# Altium schematic sheet FLASH.SchDoc
size A4
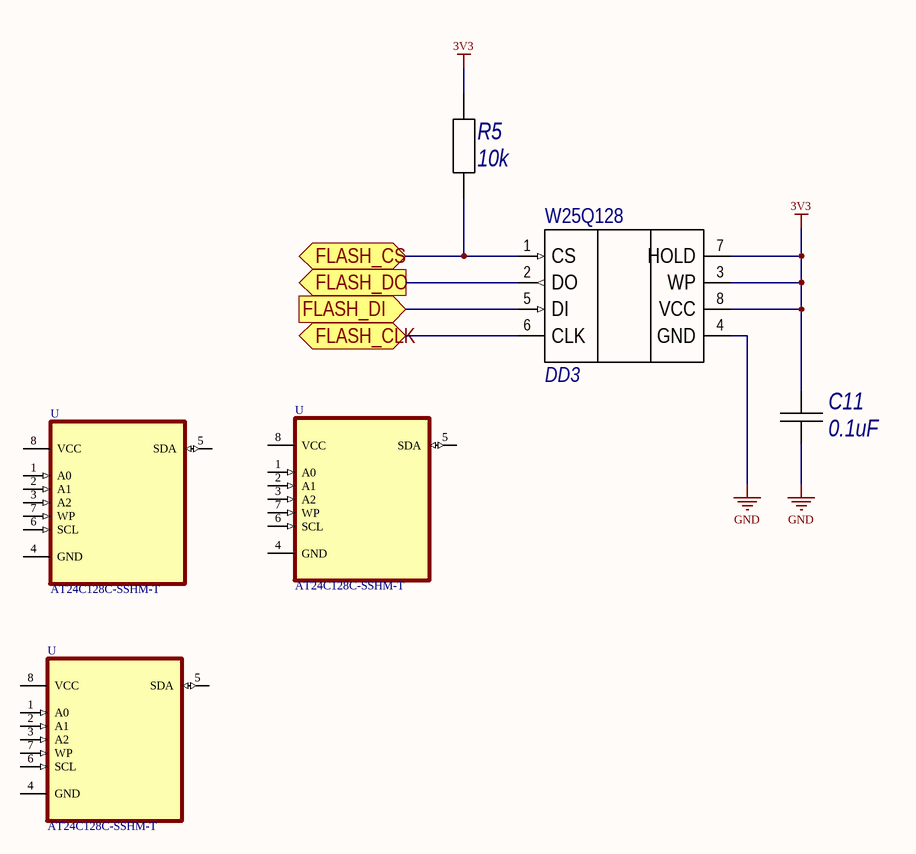
[diagram p0: FLASH.SchDoc]

## Parts
(Parts that share a designator on the sheet are numbered #1, #2 ... from top to bottom, then left to right.)
C11  0.1uF  [C0805C]
DD3  W25Q128  [SOIC8 (SO-8)]
R5  10k  [C0805R]
U#1  AT24C128C-SSHM-T  [SOIC127P600X175-8N]
U#2  AT24C128C-SSHM-T  [SOIC127P600X175-8N]
U#3  AT24C128C-SSHM-T  [SOIC127P600X175-8N]

## Ports
FLASH_CLK (bidir), FLASH_CS (bidir), FLASH_DI (in), FLASH_DO (out)

## Nets
3V3: C11.2 DD3.3(WP) DD3.7(HOLD) DD3.8(VCC) R5.2
GND: C11.1 DD3.4(GND)
FLASH_CLK: DD3.6(CLK) ; port FLASH_CLK
FLASH_CS: DD3.1(CS) R5.1 ; port FLASH_CS
FLASH_DI: DD3.5(DI) ; port FLASH_DI
FLASH_DO: DD3.2(DO) ; port FLASH_DO

Not connected (* = marked no-connect by the designer): U#1 1(A0) 2(A1) 3(A2) 4(GND) 5(SDA) 6(SCL) 7(WP) 8(VCC); U#2 1(A0) 2(A1) 3(A2) 4(GND) 5(SDA) 6(SCL) 7(WP) 8(VCC); U#3 1(A0) 2(A1) 3(A2) 4(GND) 5(SDA) 6(SCL) 7(WP) 8(VCC)

## Library data of the parts
C11 = CAP_0805: Type: Конденсатор; Published: 18.05.2010; Publisher: Andrew Danich
R5 = RES_0805: Published: 24.03.2010; Publisher: Andrew Danich; Type: Резистор
U#1-U#3 = AT24C128C-SSHM-T: EEPROM Memory IC 128Kb _16K x 8_ IÂ²C 1MHz 550ns 8-SOIC; MF: Microchip; MP: AT24C128C-SSHM-T; SnapEDA_Link: https://www.snapeda.com/parts/AT24C128C-SSHM-T/Microchip/view-part/1771999/?ref=snap; Value: *; Package: SO-8 Microchip; Price: None; Availability: Unavailable
DD3 = W25Q128: Value: *